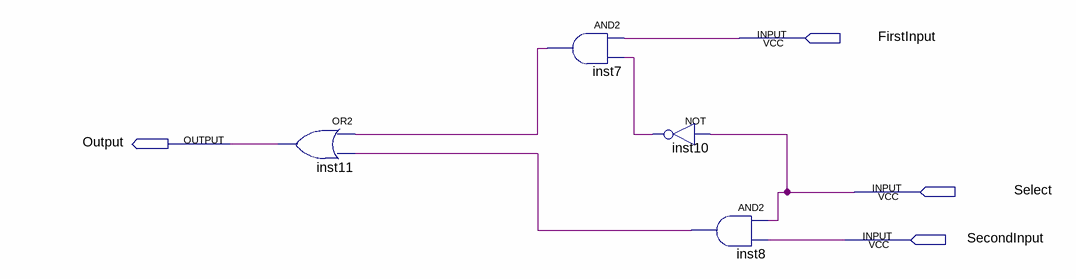
[diagram p0: schematic sheet]
// Quartus schematic Mux.bdf as structural Verilog: 4 symbols, 4 pins
module Mux (
  input  FirstInput,
  input  Select,
  input  SecondInput,
  output Output
);

  wire inst7_out, inst8_out, inst10_out;

  or inst11 (Output, inst7_out, inst8_out);
  and inst7 (inst7_out, FirstInput, inst10_out);
  not inst10 (inst10_out, Select);
  and inst8 (inst8_out, Select, SecondInput);
endmodule
